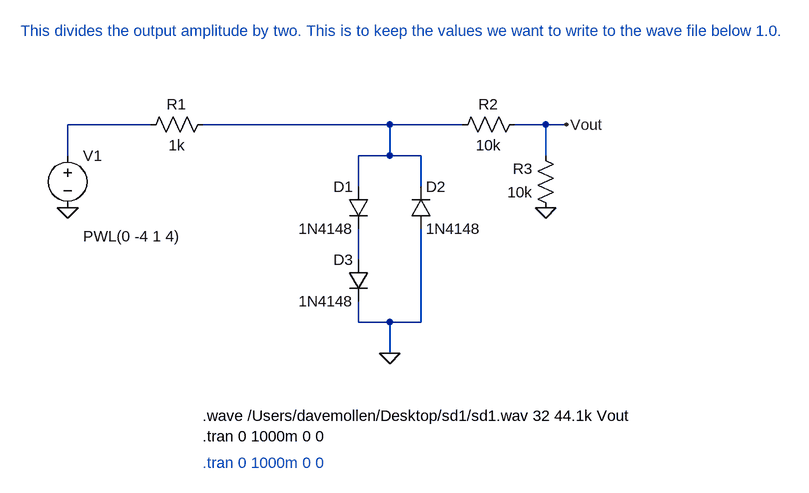
[diagram p0: schematic clipper.asc]
clipper.asc, the LTspice schematic file:
Version 4
SHEET 1 3044 724
WIRE 144 -176 16 -176
WIRE 512 -176 224 -176
WIRE 624 -176 512 -176
WIRE 752 -176 704 -176
WIRE 784 -176 752 -176
WIRE 16 -128 16 -176
WIRE 512 -128 512 -176
WIRE 512 -128 464 -128
WIRE 560 -128 512 -128
WIRE 752 -128 752 -176
WIRE 464 -80 464 -128
WIRE 560 -80 560 -128
WIRE 464 32 464 -16
WIRE 464 128 464 96
WIRE 512 128 464 128
WIRE 560 128 560 -16
WIRE 560 128 512 128
WIRE 512 176 512 128
FLAG 16 -48 0
FLAG 512 176 0
FLAG 784 -176 Vout
FLAG 752 -48 0
SYMBOL voltage 16 -144 R0
WINDOW 3 24 140 Left 2
SYMATTR Value PWL(0 -4 1 4)
SYMATTR Value2 AC 1 0
SYMATTR InstName V1
SYMBOL diode 480 -80 M0
SYMATTR InstName D1
SYMATTR Value 1N4148
SYMBOL diode 544 -16 M180
WINDOW 0 24 64 Left 2
WINDOW 3 24 0 Left 2
SYMATTR InstName D2
SYMATTR Value 1N4148
SYMBOL res 240 -192 R90
WINDOW 0 0 56 VBottom 2
WINDOW 3 32 56 VTop 2
SYMATTR InstName R1
SYMATTR Value 1k
SYMBOL diode 480 32 M0
SYMATTR InstName D3
SYMATTR Value 1N4148
SYMBOL res 720 -192 R90
WINDOW 0 0 56 VBottom 2
WINDOW 3 32 56 VTop 2
SYMATTR InstName R2
SYMATTR Value 10k
SYMBOL res 768 -32 R180
WINDOW 0 36 76 Left 2
WINDOW 3 36 40 Left 2
SYMATTR InstName R3
SYMATTR Value 10k
TEXT 224 344 Left 2 ;.tran 0 1000m 0 0
TEXT 224 272 Left 2 !.wave /Users/davemollen/Desktop/sd1/sd1.wav 32 44.1k Vout\n.tran 0 1000m 0 0
TEXT -56 -320 Left 2 ;This divides the output amplitude by two. This is to keep the values we want to write to the wave file below 1.0.

The netlist it stands for:
* clipper.asc
V1 N001 0 PWL(0 -4 1 4) AC 1 0
D1 N002 N003 1N4148
D2 0 N002 1N4148
R1 N002 N001 1k
D3 N003 0 1N4148
R2 Vout N002 10k
R3 0 Vout 10k
.model D D
.lib standard.dio
* .tran 0 1000m 0 0
.wave /Users/davemollen/Desktop/sd1/sd1.wav 32 44.1k Vout
.tran 0 1000m 0 0
* This divides the output amplitude by two. This is to keep the values we want to write to the wave file below 1.0.
.backanno
.end